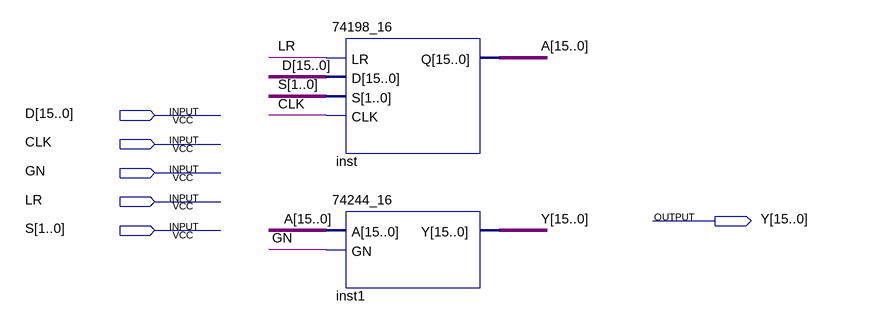
[diagram p0: schematic sheet]
// Quartus schematic Shift_Register.bdf as structural Verilog: 2 symbols, 6 pins
module Shift_Register (
  input  [15:0] D,
  input  CLK,
  input  GN,
  input  LR,
  input  [1:0] S,
  output [15:0] Y
);

  wire [15:0] A;

  \74198_16  inst (.LR(LR), .D(D), .S(S), .CLK(CLK), .Q(A));
  \74244_16  inst1 (.A(A), .GN(GN), .Y(Y));
endmodule
